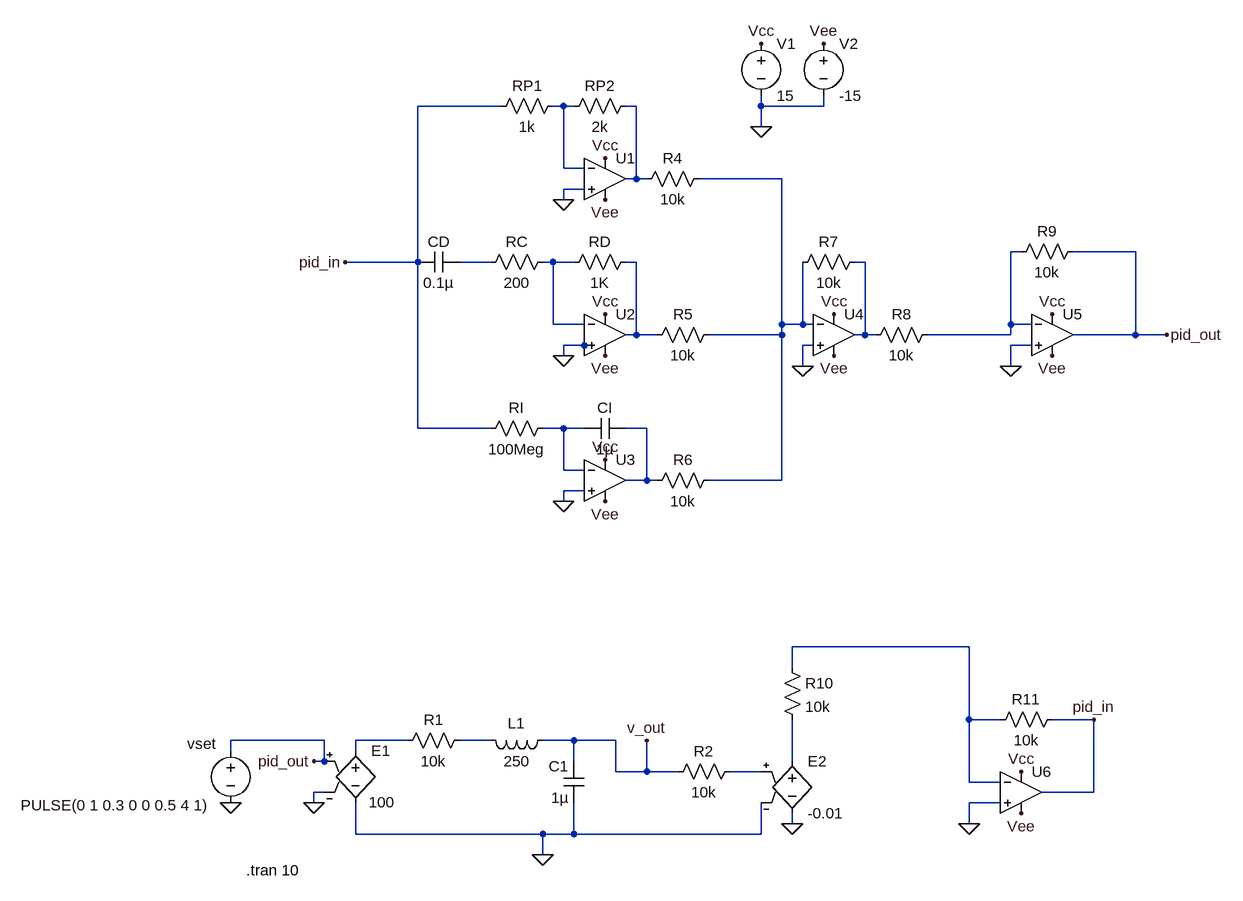
[diagram p0: schematic pid2_2.asc]
pid2_2.asc, the LTspice schematic file:
Version 4
SHEET 1 880 1132
WIRE -800 -64 -928 -64
WIRE -704 -64 -720 -64
WIRE -688 -64 -704 -64
WIRE -592 -64 -608 -64
WIRE -400 -64 -400 -80
WIRE -304 -64 -304 -80
WIRE -304 -64 -400 -64
WIRE -400 -32 -400 -64
WIRE -704 32 -704 -64
WIRE -672 32 -704 32
WIRE -592 48 -592 -64
WIRE -592 48 -608 48
WIRE -576 48 -592 48
WIRE -368 48 -496 48
WIRE -672 64 -704 64
WIRE -704 80 -704 64
WIRE 0 160 -16 160
WIRE 176 160 80 160
WIRE -928 176 -928 -64
WIRE -928 176 -1040 176
WIRE -816 176 -864 176
WIRE -720 176 -736 176
WIRE -688 176 -720 176
WIRE -592 176 -608 176
WIRE -240 176 -256 176
WIRE -720 272 -720 176
WIRE -672 272 -720 272
WIRE -368 272 -368 48
WIRE -336 272 -336 176
WIRE -336 272 -368 272
WIRE -320 272 -336 272
WIRE -16 272 -16 160
WIRE 16 272 -16 272
WIRE -592 288 -592 176
WIRE -592 288 -608 288
WIRE -560 288 -592 288
WIRE -368 288 -368 272
WIRE -368 288 -480 288
WIRE -240 288 -240 176
WIRE -240 288 -256 288
WIRE -224 288 -240 288
WIRE -16 288 -16 272
WIRE -16 288 -144 288
WIRE 176 288 176 160
WIRE 176 288 80 288
WIRE 224 288 176 288
WIRE -672 304 -704 304
WIRE -656 304 -672 304
WIRE -320 304 -336 304
WIRE 16 304 -16 304
WIRE -704 320 -704 304
WIRE -336 336 -336 304
WIRE -16 336 -16 304
WIRE -928 432 -928 176
WIRE -816 432 -928 432
WIRE -704 432 -736 432
WIRE -672 432 -704 432
WIRE -576 432 -608 432
WIRE -704 496 -704 432
WIRE -672 496 -704 496
WIRE -576 512 -576 432
WIRE -576 512 -608 512
WIRE -560 512 -576 512
WIRE -368 512 -368 288
WIRE -368 512 -480 512
WIRE -672 528 -704 528
WIRE -704 544 -704 528
WIRE -80 768 -352 768
WIRE -352 800 -352 768
WIRE -80 880 -80 768
WIRE -32 880 -80 880
WIRE 112 880 48 880
WIRE -1072 912 -1216 912
WIRE -944 912 -1024 912
WIRE -816 912 -864 912
WIRE -688 912 -736 912
WIRE -624 912 -688 912
WIRE -1216 928 -1216 912
WIRE -1024 928 -1024 912
WIRE -1072 944 -1072 912
WIRE -1072 944 -1088 944
WIRE -688 944 -688 912
WIRE -352 944 -352 880
WIRE -624 960 -624 912
WIRE -576 960 -576 912
WIRE -576 960 -624 960
WIRE -528 960 -576 960
WIRE -400 960 -448 960
WIRE -80 976 -80 880
WIRE -32 976 -80 976
WIRE -1072 992 -1088 992
WIRE 112 992 112 880
WIRE 112 992 32 992
WIRE -1088 1008 -1088 992
WIRE -32 1008 -80 1008
WIRE -352 1040 -352 1024
WIRE -80 1040 -80 1008
WIRE -1024 1056 -1024 1008
WIRE -736 1056 -1024 1056
WIRE -688 1056 -688 1008
WIRE -688 1056 -736 1056
WIRE -400 1056 -400 1008
WIRE -400 1056 -688 1056
WIRE -736 1088 -736 1056
FLAG -704 80 0
FLAG -704 320 0
FLAG -704 544 0
FLAG -336 336 0
FLAG -16 336 0
FLAG -400 -32 0
FLAG -400 -160 Vcc
FLAG -640 16 Vcc
FLAG -640 256 Vcc
FLAG -640 480 Vcc
FLAG -288 256 Vcc
FLAG 48 256 Vcc
FLAG -304 -160 Vee
FLAG -640 80 Vee
FLAG -640 320 Vee
FLAG -640 544 Vee
FLAG -288 320 Vee
FLAG 48 320 Vee
FLAG 224 288 pid_out
FLAG -1040 176 pid_in
FLAG -1088 1008 0
FLAG -736 1088 0
FLAG -576 912 v_out
FLAG -352 1040 0
FLAG 112 880 pid_in
FLAG -80 1040 0
FLAG 0 1024 Vee
FLAG 0 960 Vcc
FLAG -1088 944 pid_out
FLAG -1216 1008 0
DATAFLAG -1136 912 ""
SYMBOL OpAmps\\UniversalOpAmp -640 48 R0
SYMATTR InstName U1
SYMBOL OpAmps\\UniversalOpAmp -640 288 R0
SYMATTR InstName U2
SYMBOL OpAmps\\UniversalOpAmp -640 512 R0
SYMATTR InstName U3
SYMBOL OpAmps\\UniversalOpAmp -288 288 R0
SYMATTR InstName U4
SYMBOL OpAmps\\UniversalOpAmp 48 288 R0
SYMATTR InstName U5
SYMBOL res -704 -80 R90
WINDOW 0 0 56 VBottom 2
WINDOW 3 32 56 VTop 2
SYMATTR InstName RP1
SYMATTR Value 1k
SYMBOL res -592 -80 R90
WINDOW 0 0 56 VBottom 2
WINDOW 3 32 56 VTop 2
SYMATTR InstName RP2
SYMATTR Value 2k
SYMBOL res -592 160 R90
WINDOW 0 0 56 VBottom 2
WINDOW 3 32 56 VTop 2
SYMATTR InstName RD
SYMATTR Value 1K
SYMBOL res -720 160 R90
WINDOW 0 0 56 VBottom 2
WINDOW 3 32 56 VTop 2
SYMATTR InstName RC
SYMATTR Value 200
SYMBOL res -720 416 R90
WINDOW 0 0 56 VBottom 2
WINDOW 3 32 56 VTop 2
SYMATTR InstName RI
SYMATTR Value 100Meg
SYMBOL res -464 496 R90
WINDOW 0 0 56 VBottom 2
WINDOW 3 32 56 VTop 2
SYMATTR InstName R6
SYMATTR Value 10k
SYMBOL res -464 272 R90
WINDOW 0 0 56 VBottom 2
WINDOW 3 32 56 VTop 2
SYMATTR InstName R5
SYMATTR Value 10k
SYMBOL res -480 32 R90
WINDOW 0 0 56 VBottom 2
WINDOW 3 32 56 VTop 2
SYMATTR InstName R4
SYMATTR Value 10k
SYMBOL res -128 272 R90
WINDOW 0 0 56 VBottom 2
WINDOW 3 32 56 VTop 2
SYMATTR InstName R8
SYMATTR Value 10k
SYMBOL res -240 160 R90
WINDOW 0 0 56 VBottom 2
WINDOW 3 32 56 VTop 2
SYMATTR InstName R7
SYMATTR Value 10k
SYMBOL res 96 144 R90
WINDOW 0 0 56 VBottom 2
WINDOW 3 32 56 VTop 2
SYMATTR InstName R9
SYMATTR Value 10k
SYMBOL cap -864 160 R90
WINDOW 0 0 32 VBottom 2
WINDOW 3 32 32 VTop 2
SYMATTR InstName CD
SYMATTR Value 0.1µ
SYMBOL cap -608 416 R90
WINDOW 0 0 32 VBottom 2
WINDOW 3 32 32 VTop 2
SYMATTR InstName CI
SYMATTR Value 1µ
SYMBOL voltage -400 -176 R0
SYMATTR InstName V1
SYMATTR Value 15
SYMBOL voltage -304 -176 R0
SYMATTR InstName V2
SYMATTR Value -15
SYMBOL e -1024 912 R0
WINDOW 3 20 95 Left 2
SYMATTR Value 100
SYMATTR InstName E1
SYMBOL e -352 928 R0
SYMATTR InstName E2
SYMATTR Value -0.01
SYMBOL OpAmps\\UniversalOpAmp 0 992 R0
SYMATTR InstName U6
SYMBOL voltage -1216 912 R0
WINDOW 123 0 0 Left 0
WINDOW 39 0 0 Left 0
WINDOW 0 -67 5 Left 2
WINDOW 3 -323 100 Left 2
SYMATTR InstName vset
SYMATTR Value PULSE(0 1 0.3 0 0 0.5 4 1)
SYMBOL res -368 784 R0
SYMATTR InstName R10
SYMATTR Value 10k
SYMBOL res 64 864 R90
WINDOW 0 0 56 VBottom 2
WINDOW 3 32 56 VTop 2
SYMATTR InstName R11
SYMATTR Value 10k
SYMBOL ind -720 896 R90
WINDOW 0 5 56 VBottom 2
WINDOW 3 32 56 VTop 2
SYMATTR InstName L1
SYMATTR Value 250
SYMBOL res -432 944 R90
WINDOW 0 0 56 VBottom 2
WINDOW 3 32 56 VTop 2
SYMATTR InstName R2
SYMATTR Value 10k
SYMBOL res -848 896 R90
WINDOW 0 0 56 VBottom 2
WINDOW 3 32 56 VTop 2
SYMATTR InstName R1
SYMATTR Value 10k
SYMBOL cap -672 1008 R180
WINDOW 0 24 56 Left 2
WINDOW 3 24 8 Left 2
SYMATTR InstName C1
SYMATTR Value 1µ
TEXT -1192 1112 Left 2 !.tran 10

The netlist it stands for:
* pid2_2.asc
XU1 0 N001 Vcc Vee N002 level1 Avol=1Meg GBW=10Meg Vos=0 En=0 Enk=0 In=0 Ink=0 Rin=500Meg  ; pins In+ In- V+ V- OUT
XU2 0 N006 Vcc Vee N007 level1 Avol=1Meg GBW=10Meg Vos=0 En=0 Enk=0 In=0 Ink=0 Rin=500Meg  ; pins In+ In- V+ V- OUT
XU3 0 N009 Vcc Vee N010 level1 Avol=1Meg GBW=10Meg Vos=0 En=0 Enk=0 In=0 Ink=0 Rin=500Meg  ; pins In+ In- V+ V- OUT
XU4 0 N003 Vcc Vee N008 level1 Avol=1Meg GBW=10Meg Vos=0 En=0 Enk=0 In=0 Ink=0 Rin=500Meg  ; pins In+ In- V+ V- OUT
XU5 0 N004 Vcc Vee pid_out level1 Avol=1Meg GBW=10Meg Vos=0 En=0 Enk=0 In=0 Ink=0 Rin=500Meg  ; pins In+ In- V+ V- OUT
RP1 N001 pid_in 1k
RP2 N002 N001 2k
RD N007 N006 1K
RC N006 N005 200
RI N009 pid_in 100Meg
R6 N003 N010 10k
R5 N003 N007 10k
R4 N003 N002 10k
R8 N004 N008 10k
R7 N008 N003 10k
R9 pid_out N004 10k
CD N005 pid_in 0.1µ
CI N010 N009 1µ
V1 Vcc 0 15
V2 Vee 0 -15
E1 N012 0 pid_out 0 100
E2 N014 0 N015 0 -0.01
XU6 0 N011 Vcc Vee pid_in level1 Avol=1Meg GBW=10Meg Vos=0 En=0 Enk=0 In=0 Ink=0 Rin=500Meg  ; pins In+ In- V+ V- OUT
vset pid_out 0 PULSE(0 1 0.3 0 0 0.5 4 1)
R10 N011 N014 10k
R11 pid_in N011 10k
L1 v_out N013 250
R2 N015 v_out 10k
R1 N013 N012 10k
C1 0 v_out 1µ
.tran 10
.lib UniversalOpAmp1.lib
.backanno
.end